# Altium schematic sheet ciclo_V1.SchDoc
size A4; SheetNumber: 1; SheetTotal: 1
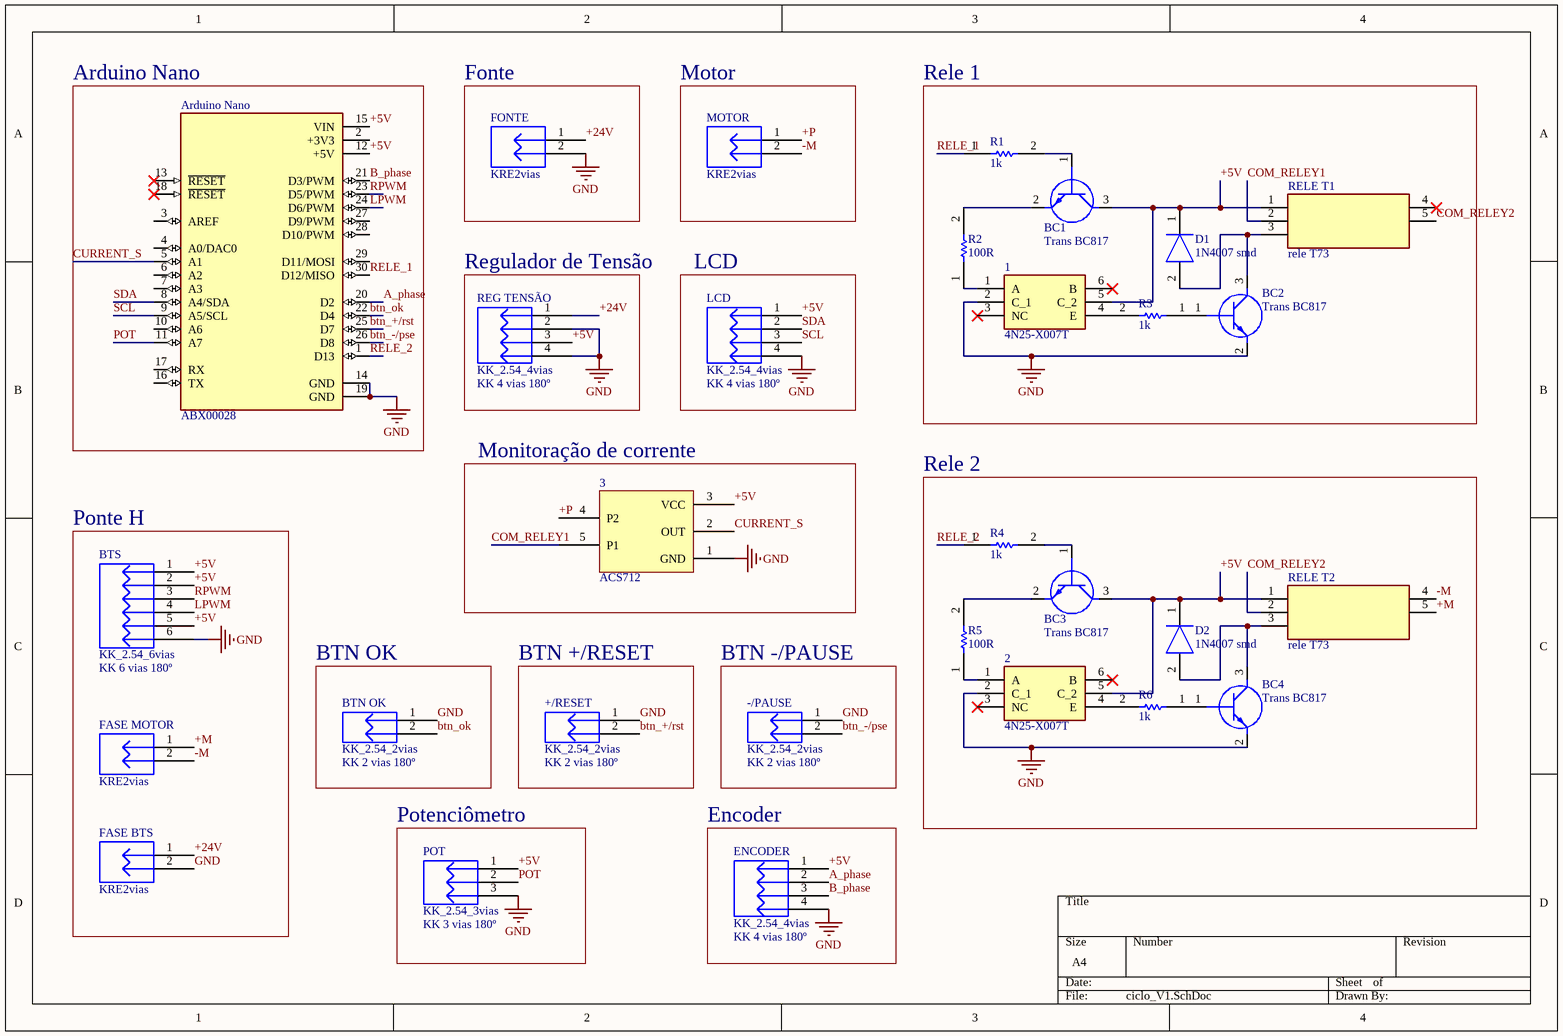
[diagram p0: ciclo_V1.SchDoc]

## Parts
1  4N25-X007T  [SOP254P1030X440-6N]
2  4N25-X007T  [SOP254P1030X440-6N]
3  ACS712  [ACS712]
+/RESET  KK_2.54_2vias  Valor: KK 2 vias 180º  [KK_2VIAS_180º]
-/PAUSE  KK_2.54_2vias  Valor: KK 2 vias 180º  [KK_2VIAS_180º]
Arduino_Nano  ABX00028  [MODULE_A000005]
BC1  Trans BC817  [SOT96P240X110-3N]
BC2  Trans BC817  [SOT96P240X110-3N]
BC3  Trans BC817  [SOT96P240X110-3N]
BC4  Trans BC817  [SOT96P240X110-3N]
BTN_OK  KK_2.54_2vias  Valor: KK 2 vias 180º  [KK_2VIAS_180º]
BTS  KK_2.54_6vias  Valor: KK 6 vias 180º  [KK_6vias_180°]
D1  1N4007 smd  [DIOM5327X242N]
D2  1N4007 smd  [DIOM5327X242N]
ENCODER  KK_2.54_4vias  Valor: KK 4 vias 180º  [KK_4vias_180°]
FASE_BTS  KRE2vias  [KRE2-2vias]
FASE_MOTOR  KRE2vias  [KRE2-2vias]
FONTE  KRE2vias  [KRE2-2vias]
LCD  KK_2.54_4vias  Valor: KK 4 vias 180º  [KK_4vias_180°]
MOTOR  KRE2vias  [KRE2-2vias]
POT  KK_2.54_3vias  Valor: KK 3 vias 180º  [KK_3vias_180º]
R1  1k  [RESC3216X60N]
R2  100R  [RESC3216X60N]
R3  1k  [RESC3216X60N]
R4  1k  [RESC3216X60N]
R5  100R  [RESC3216X60N]
R6  1k  [RESC3216X60N]
REG_TENSÃO  KK_2.54_4vias  Valor: KK 4 vias 180º  [KK_4vias_180°]
RELE_T1  rele T73  [JQC3FT731Z12VDC]
RELE_T2  rele T73  [JQC3FT731Z12VDC]

## Blocks framed on the sheet
Arduino Nano: Arduino_Nano
Fonte: FONTE
Motor: MOTOR
Rele 1: 1 BC1 BC2 D1 R1-R3 RELE_T1
Regulador de Tensão: REG_TENSÃO
LCD: LCD
Monitoração de corrente: 3
Rele 2: 2 BC3 BC4 D2 R4-R6 RELE_T2
Ponte H: BTS FASE_BTS FASE_MOTOR
BTN OK: BTN_OK
BTN +/RESET: +/RESET
BTN -/PAUSE: -/PAUSE
Potenciômetro: POT
Encoder: ENCODER

## Nets
GND: 1.2(C_1) 2.2(C_1) 3.1(GND) +/RESET.1 -/PAUSE.1 Arduino_Nano.14(GND) Arduino_Nano.19(GND) BC2.2(E) BC4.2(E) BTN_OK.1 BTS.6 ENCODER.4 FASE_BTS.2 FONTE.2 LCD.4 POT.3 REG_TENSÃO.2 REG_TENSÃO.4
+5V: 1.5(C_2) 2.5(C_2) 3.3(VCC) Arduino_Nano.12(+5V) Arduino_Nano.15(VIN) BC1.3(C) BC3.3(C) BTS.1 BTS.2 BTS.5 D1.1(K) D2.1(K) ENCODER.1 LCD.1 POT.1 REG_TENSÃO.3 RELE_T1.1(COIL_1) RELE_T2.1(COIL_1)
+24V: FASE_BTS.1 FONTE.1 REG_TENSÃO.1
+M: FASE_MOTOR.1 RELE_T2.5(COM)
+P: 3.4(P2) MOTOR.1
-M: FASE_MOTOR.2 MOTOR.2 RELE_T2.4(COIL_2)
A_phase: Arduino_Nano.20(D2) ENCODER.2
B_phase: Arduino_Nano.21(D3/PWM) ENCODER.3
btn_+/rst: +/RESET.2 Arduino_Nano.25(D7)
btn_-/pse: -/PAUSE.2 Arduino_Nano.26(D8)
btn_ok: Arduino_Nano.22(D4) BTN_OK.2
COM_RELEY1: 3.5(P1) RELE_T1.2(NC)
COM_RELEY2: RELE_T1.5(COM) RELE_T2.2(NC)
CURRENT_S: 3.2(OUT) Arduino_Nano.5(A1)
LPWM: Arduino_Nano.24(D6/PWM) BTS.4
POT: Arduino_Nano.11(A7) POT.2
RELE_1: Arduino_Nano.30(D12/MISO) R1.1
RELE_2: Arduino_Nano.1(D13) R4.1
RPWM: Arduino_Nano.23(D5/PWM) BTS.3
SCL: Arduino_Nano.9(A5/SCL) LCD.3
SDA: Arduino_Nano.8(A4/SDA) LCD.2
Net1_1: 1.1(A) R2.1
Net1_4: 1.4(E) R3.2
Net2_1: 2.1(A) R5.1
Net2_4: 2.4(E) R6.2
NetBC1_1: BC1.1(B) R1.2
NetBC1_2: BC1.2(E) R2.2
NetBC2_1: BC2.1(B) R3.1
NetBC2_3: BC2.3(C) D1.2(A) RELE_T1.3(NO)
NetBC3_1: BC3.1(B) R4.2
NetBC3_2: BC3.2(E) R5.2
NetBC4_1: BC4.1(B) R6.1
NetBC4_3: BC4.3(C) D2.2(A) RELE_T2.3(NO)

Not connected (* = marked no-connect by the designer): 1 3(NC)* 6(B)*; 2 3(NC)* 6(B)*; Arduino_Nano 2(+3V3) 3(AREF) 4(A0/DAC0) 6(A2) 7(A3) 10(A6) 13(~{RESET})* 16(TX) 17(RX) 18(~{RESET})* 27(D9/PWM) 28(D10/PWM) 29(D11/MOSI); RELE_T1 4(COIL_2)*

## Library data of the parts
1 2 = 4N25-X007T: Phototransistor; Manufacturer_Name: Vishay; Datasheet Link: https://eu.mouser.com/datasheet/2/427/4n25x000-1767213.pdf; Height: 4.4mm; Manufacturer_Part_Number: 4N25-X007T; Mouser Part Number: 782-4N25-X007T; Mouser Price/Stock: https://www.mouser.com/Search/Refine.aspx?Keyword=782-4N25-X007T; Arrow Part Number: 4N25-X007T; Arrow Price/Stock: https://www.arrow.com/en/products/4n25-x007t/vishay
+/RESET -/PAUSE BTN_OK = KK_2.54_2vias: Conector KK 2.54mm 2 vias; Descrição: Conector KK 3 vias com passo 2.54mm; Encapsulamento: PTH - 180º; Modelo: 2 vias - 180º; Marca: *; Observação: *
Arduino_Nano = ABX00028: ATmega4809 Arduino Nano Every AVRÂ® AVR MCU 8-Bit Embedded Evaluation Board; Check_prices: https://www.snapeda.com/parts/ABX00028/Arduino/view-part/3656170/?ref=eda; Availability: In Stock; Value: *; MF: Arduino; Price: None; Purchase-URL: https://pricing.snapeda.com/search/part/ABX00028/?ref=eda; MP: ABX00028; Package: None; SnapEDA_Link: https://www.snapeda.com/parts/ABX00028/Arduino/view-part/3656170/?ref=snap
BC1-BC4 = Trans BC817: Transistor BJT NPN BC817-25-7-F; Manufacturer_Name: Diodes Inc.; Datasheet Link: https://www.diodes.com/assets/Datasheets/ds11107.pdf; Height: 1.1mm; Manufacturer_Part_Number: BC817-25-7-F; Mouser Part Number: 621-BC817-25-7-F; Mouser Price/Stock: https://www.mouser.co.uk/ProductDetail/Diodes-Incorporated/BC817-25-7-F?qs=rGAXPo9uwV0jK0EyLZnqOw%3D%3D; Arrow Part Number: BC817-25-7-F; Arrow Price/Stock: https://www.arrow.com/en/products/bc817-25-7-f/diodes-incorporated
BTS = KK_2.54_6vias: Conector KK 2.54mm 6 vias; Descrição: Conector KK 3 vias com passo 2.54mm; Encapsulamento: PTH - 180º; Modelo: 3 vias - 180º; Marca: *; Observação: *
D1 D2 = 1N4007 smd: Diode smd; Manufacturer_Name: Shikues; Datasheet Link: https://datasheet.lcsc.com/szlcsc/SK-1N4007_C126233.pdf; Height: 2.42mm; Manufacturer_Part_Number: 1N4007
ENCODER LCD REG_TENSÃO = KK_2.54_4vias: Conector KK 2.54mm 4 vias; Descrição: Conector KK 3 vias com passo 2.54mm; Encapsulamento: PTH - 180º; Modelo: 3 vias - 180º; Marca: *; Observação: *
FASE_BTS FASE_MOTOR FONTE MOTOR = KRE2vias: Conector 2 vias; Descrição: Conector KRE 2 vias 180º; Encapsulamento: PTH - 180º; Modelo: 2 vias - 180º; Marca: *; Observação: *
POT = KK_2.54_3vias: Conector KK 2.54mm 3 vias; Descrição: Conector KK 3 vias com passo 2.54mm; Encapsulamento: PTH - 180º; Modelo: 3 vias - 180º; Marca: *; Observação: *
R1-R6 = RES 1206: RES 1206 5%; Manufacturer_Name: Vishay; Manufacturer_Part_Number: CRCW12064K70FKEA; Datasheet Link: http://docs-emea.rs-online.com/webdocs/13ec/0900766b813ecc08.pdf; Height: 0.6mm; Mouser Part Number: 71-CRCW1206-4.7K-E3; Mouser Price/Stock: https://www.mouser.co.uk/ProductDetail/Vishay-Dale/CRCW12064K70FKEA?qs=1vm4qhDHCvlKJmatsKzyFQ%3D%3D; Arrow Part Number: CRCW12064K70FKEA; Arrow Price/Stock: https://www.arrow.com/en/products/crcw12064k70fkea/vishay
RELE_T1 RELE_T2 = rele T73: Relay or Contactor; Manufacturer_Name: QIANJI; Manufacturer_Part_Number: JQC-3F-(T73)-1Z-12VDC; Datasheet Link: https://img.ozdisan.com/ETicaret_Dosya/341245_8627675.pdf; Height: 15.5mm